# Altium schematic sheet 2xparallelswitch.SchDoc: RP2040 CNC
size B; Author: AM; CompanyName: Expatria Technologies; DrawnBy: A.Marles; Engineer: AM; Organization: Expatria Technolgoies; DocumentNumber: 6; SheetNumber: 6; SheetTotal: 22
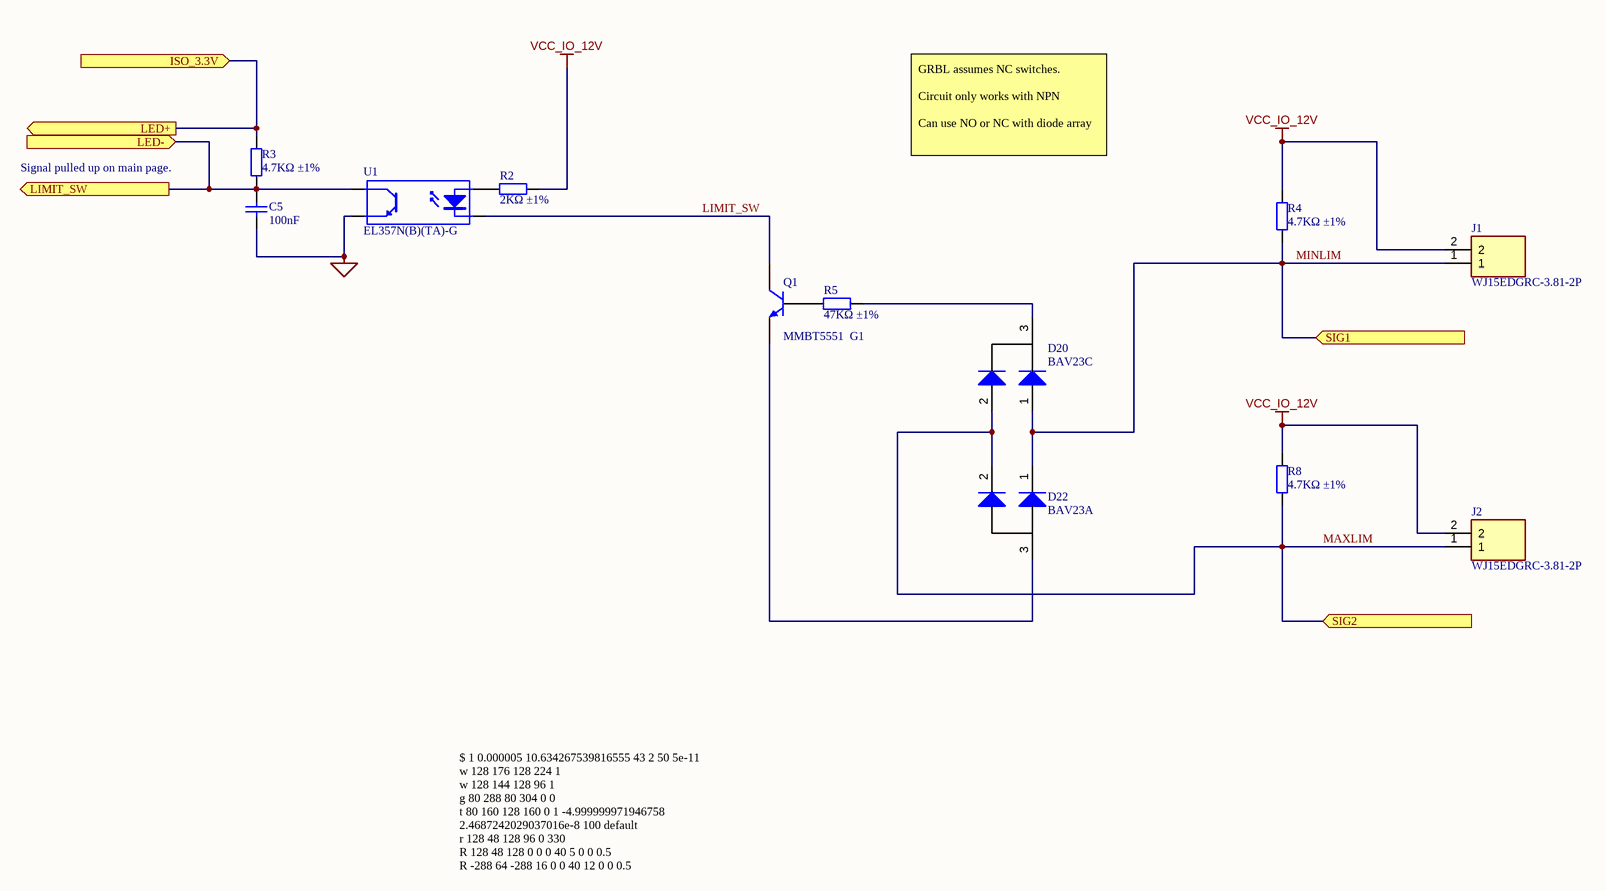
[diagram p0: 2xparallelswitch.SchDoc]

## Parts
C5  100nF  [0603_C]
D20  BAV23C  [SOT-23(SOT-23-3)]
D22  BAV23A  [SOT-23(SOT-23-3)]
J1  WJ15EDGRC-3.81-2P  [SHDRRA2W85P0X381_1X2_850X915X720P]
J2  WJ15EDGRC-3.81-2P  [SHDRRA2W85P0X381_1X2_850X915X720P]
Q1  MMBT5551  G1  [SOT-23(SOT-23-3)]
R2  2KΩ ±1%  [0603_R]
R3  4.7KΩ ±1%  [0603_R]
R4  4.7KΩ ±1%  [0603_R]
R5  47KΩ ±1%  [0603_R]
R8  4.7KΩ ±1%  [0603_R]
U1  EL357N(B)(TA)-G  [SOP-4_P2.54]

## Ports
ISO_3.3V (in), LED+ (out), LED- (in), LIMIT_SW (out), SIG1 (in), SIG2 (in)

## Nets
MCU_GND: C5.1 U1.3(E)
VCC_IO_12V: J1.2 J2.2 R2.2 R4.2 R8.2
ISO_3.3V: R3.2 ; port LED+, port ISO_3.3V
LED-: C5.2 R3.1 U1.4(C) ; port LIMIT_SW, port LED-
LIMIT_SW: Q1.3(C) U1.2(K)
MAXLIM: D20.2(A) D22.2(K) J2.1 R8.1 ; port SIG2
MINLIM: D20.1(A) D22.1(K) J1.1 R4.1 ; port SIG1
NetD20_3: D20.3(K) R5.1
NetD22_3: D22.3(A) Q1.2(E)
NetQ1_1: Q1.1(B) R5.2
NetR2_1: R2.1 U1.1(A)

## Notes on the sheet
- Signal pulled up on main page.
- GRBL assumes NC switches.
  Circuit only works with NPN
  Can use NO or NC with diode array
- $ 1 0.000005 10.634267539816555 43 2 50 5e-11
  w 128 176 128 224 1
  w 128 144 128 96 1
  g 80 288 80 304 0 0
  t 80 160 128 160 0 1 -4.999999971946758 2.4687242029037016e-8 100 default
  r 128 48 128 96 0 330
  R 128 48 128 0 0 0 40 5 0 0 0.5
  R -288 64 -288 16 0 0 40 12 0 0 0.5
  368 128 144 288 144 0 0
  r -288 64 -288 144 0 1000
  r 80 208 80 288 0 5000
  w 128 224 128 240 0
  r 80 160 -16 160 0 1000
  g 128 240 128 256 0 0
  s -288 160 -432 160 0 0 false
  g -432 160 -432 208 0 0
  w -288 144 -288 160 0
  w -288 160 -224 160 0
  368 -432 160 -432 96 0 0
  368 -16 160 -16 96 0 0
  368 80 160 80 96 0 0
  368 128 224 256 224 0 0
  w 80 160 80 208 0
  368 -432 416 -432 352 0 0
  w -288 416 -224 416 0
  w -288 400 -288 416 0
  g -432 416 -432 464 0 0
  s -288 416 -432 416 0 0 false
  r -288 320 -288 400 0 1000
  R -288 320 -288 272 0 0 40 12 0 0 0.5
  d -224 160 -112 160 2 default
  d -224 416 -112 416 2 default
  w -112 416 -112 160 0
  w -112 160 -16 160 0
- SHEET
- Expatria Technologies
- 1136 Glade Court
- Port Coquitlam, BC V3B 1R5
- PHONE: (778) 238-9336
- PROJECT
- SIZE
- ENGR
- MODIFIED
- DOCUMENT
- REV
- Copyright Expatria Technologies 2022. This document describes Open Hardware and is licensed under the CERN-OHL-S v2. No warranty is implied or expressed.
- EMAIL: info@expatria.ca
- B
- /

## Library data of the parts
C5 = 0603 100nF (104) 10% 50V: Chip capacitors; Manufacturer: YAGEO; PartNumber: CC0603KRX7R9BB104; Tolerance: 10%; Voltage: 50V; ComponentLink1Description: Supplier link; ComponentLink1URL: http://www.szlcsc.com/product/details_15331.html; Package: 0603; Supplier: LC; SuppliersPartNumber: C14663; Capacitance: 100nF
D20 = SOT-23 BAV23C: 250V +150℃@(Tj) 350mW Dual Common Cathode 1.25V@200mA 50ns 100nA@250V 225mA SOT-23 Switching Diode ROHS; ComponentLink1Description: 供应商链接; ComponentLink1URL: http://www.szlcsc.com/product/details_70091.html; Package: SOT-23; Supplier: LC; SuppliersPartNumber: C545540
D22 = BAV23A: 200V -65℃~+150℃@(Tj) 350mW 1 Pair Common Anode 1.25V@200mA 50ns 100nA@200V 400mA SOT-23 Switching Diode ROHS; Package: SOT-23; Supplier: LC; SuppliersPartNumber: C5155398
J1 J2 = WJ15EDGRC-3.81-2P: 3.81mm Green Board Edge/Receptacle-Close Push-Pull,P=3.81mm Pluggable System Terminal Block ROHS; Manufacturer_Name: Ningbo Kangnex; SuppliersPartNumber: C8387; Datasheet Link: https://datasheet.lcsc.com/szlcsc/Ningbo-Kangnex-Elec-WJ15EDGRC-3-81-2P_C8387.pdf; Height: 7.2mm; Manufacturer_Part_Number: WJ15EDGRC-3.81-2P
Q1 = SOT-23 MMBT5551  G1: 三极管; ComponentLink1Description: 供应商链接; ComponentLink1URL: http://www.szlcsc.com/product/details_2502.html; Package: SOT-23; Supplier: LC; SuppliersPartNumber: C2145
R2 = 0603 2K (2001) 1%: Chip resistor; Manufacturer: Uniroyal Elec; PartNumber: 0603WAF2001T5E; Power: 1/10W; ComponentLink1Description: Supplier link; ComponentLink1URL: http://www.szlcsc.com/product/details_23702.html; Package: 0603; Supplier: LC; SuppliersPartNumber: C22975; Resistance: 2KΩ; Tolerance: 1%
R3 R4 R8 = 0603 4.7K (4701) 1%: Chip resistor; Manufacturer: Uniroyal Elec; PartNumber: 0603WAF4701T5E; Power: 1/10W; ComponentLink1Description: Supplier link; ComponentLink1URL: http://www.szlcsc.com/product/details_23889.html; Package: 0603; Supplier: LC; SuppliersPartNumber: C23162; Resistance: 4.7KΩ; Tolerance: 1%
R5 = 0603 47K (4702) 1%: Chip resistor; Manufacturer: Uniroyal Elec; PartNumber: 0603WAF4702T5E; Power: 1/10W; ComponentLink1Description: Supplier link; ComponentLink1URL: http://www.szlcsc.com/product/details_26562.html; Package: 0603; Supplier: LC; SuppliersPartNumber: C25819; Resistance: 47KΩ; Tolerance: 1%
U1 = EL357N(B)(TA)-G_[C6649]: 贴片光耦; ComponentLink1Description: 供应商链接; ComponentLink1URL: http://www.szlcsc.com/product/details_7114.html; Package: SOP-4_P2.54; Supplier: LC; SuppliersPartNumber: C6649